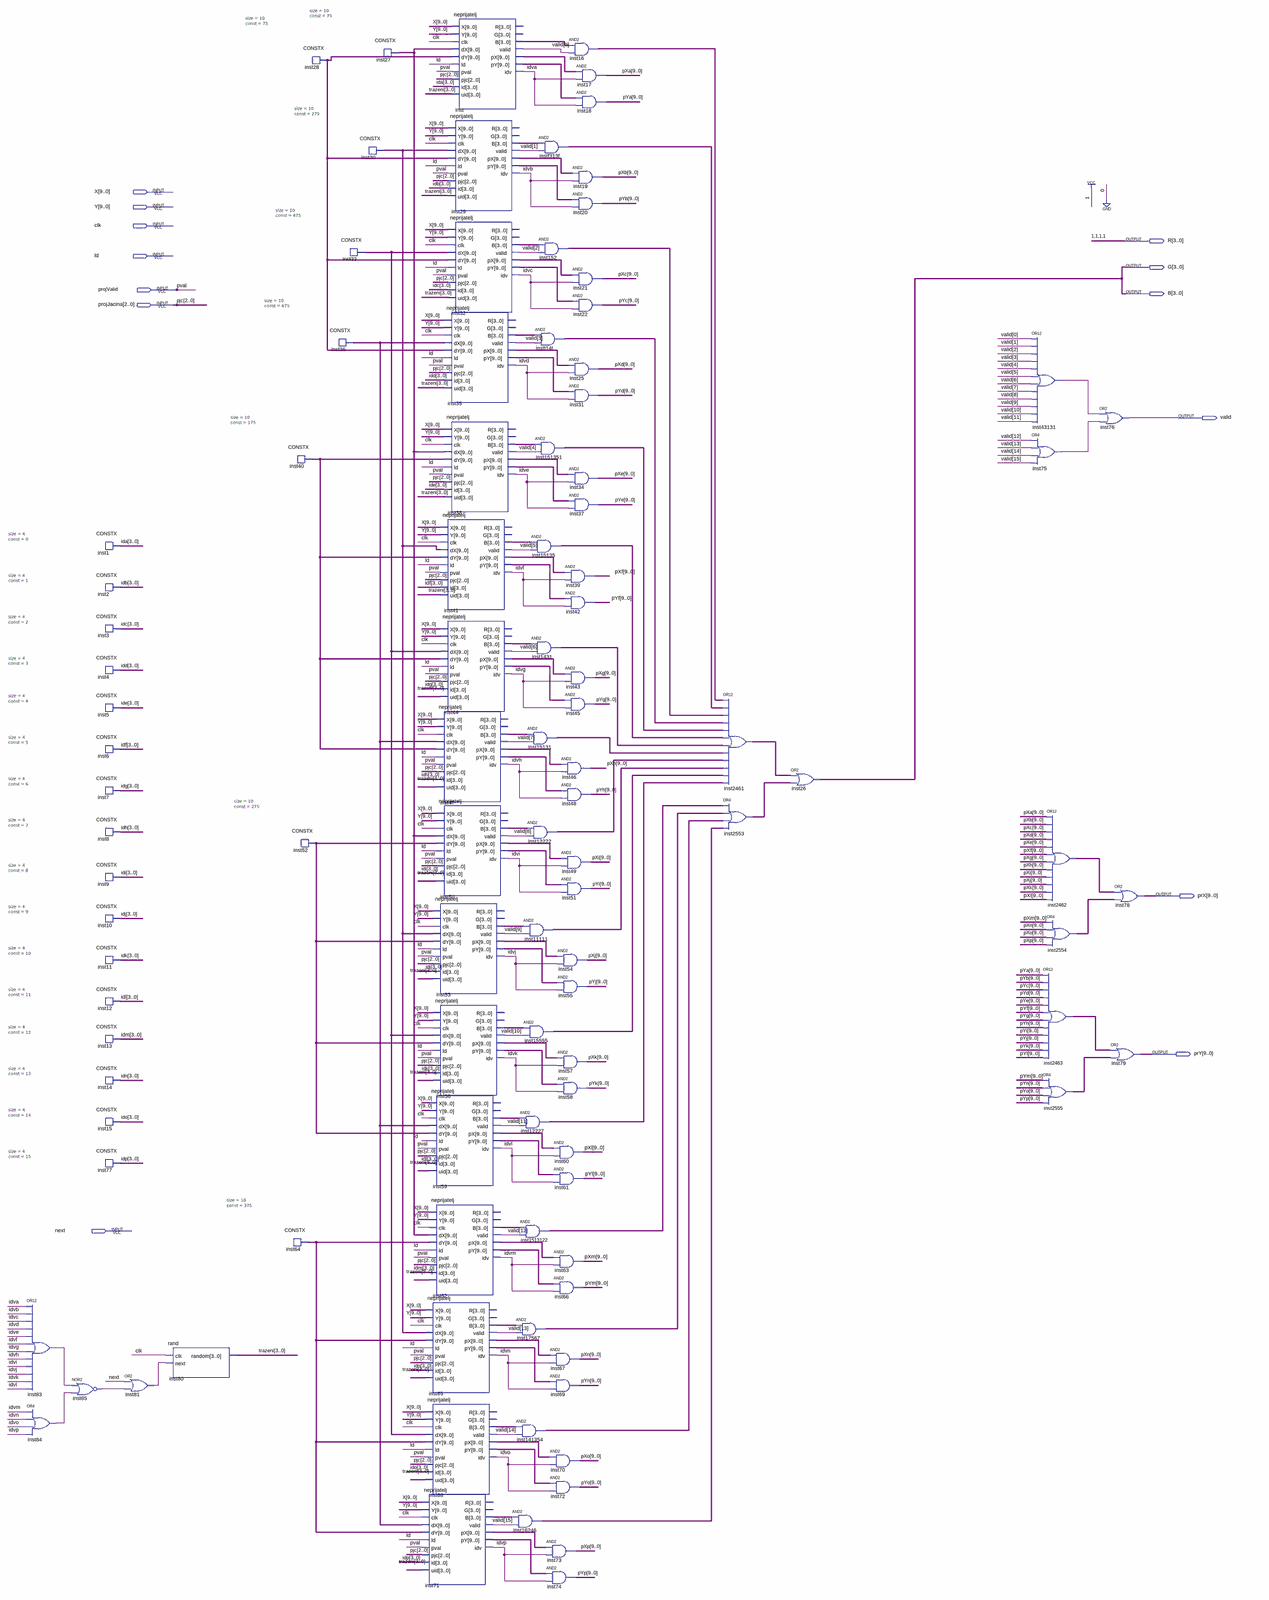
[diagram p0: schematic sheet, whole]
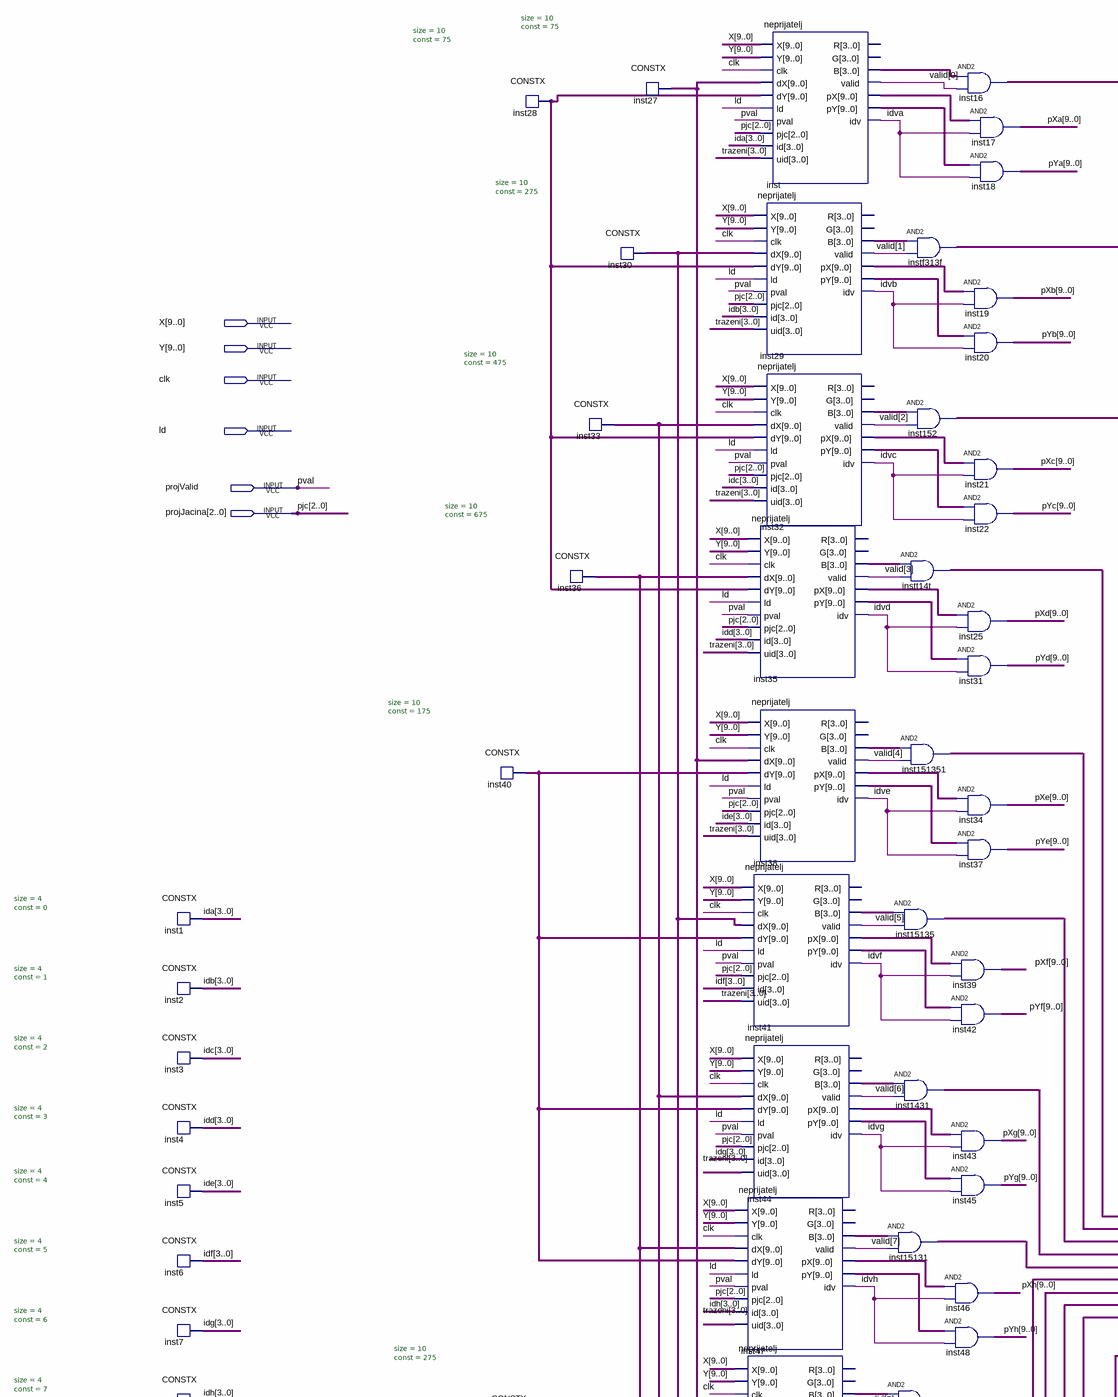
[diagram p1: schematic sheet, upper left part]
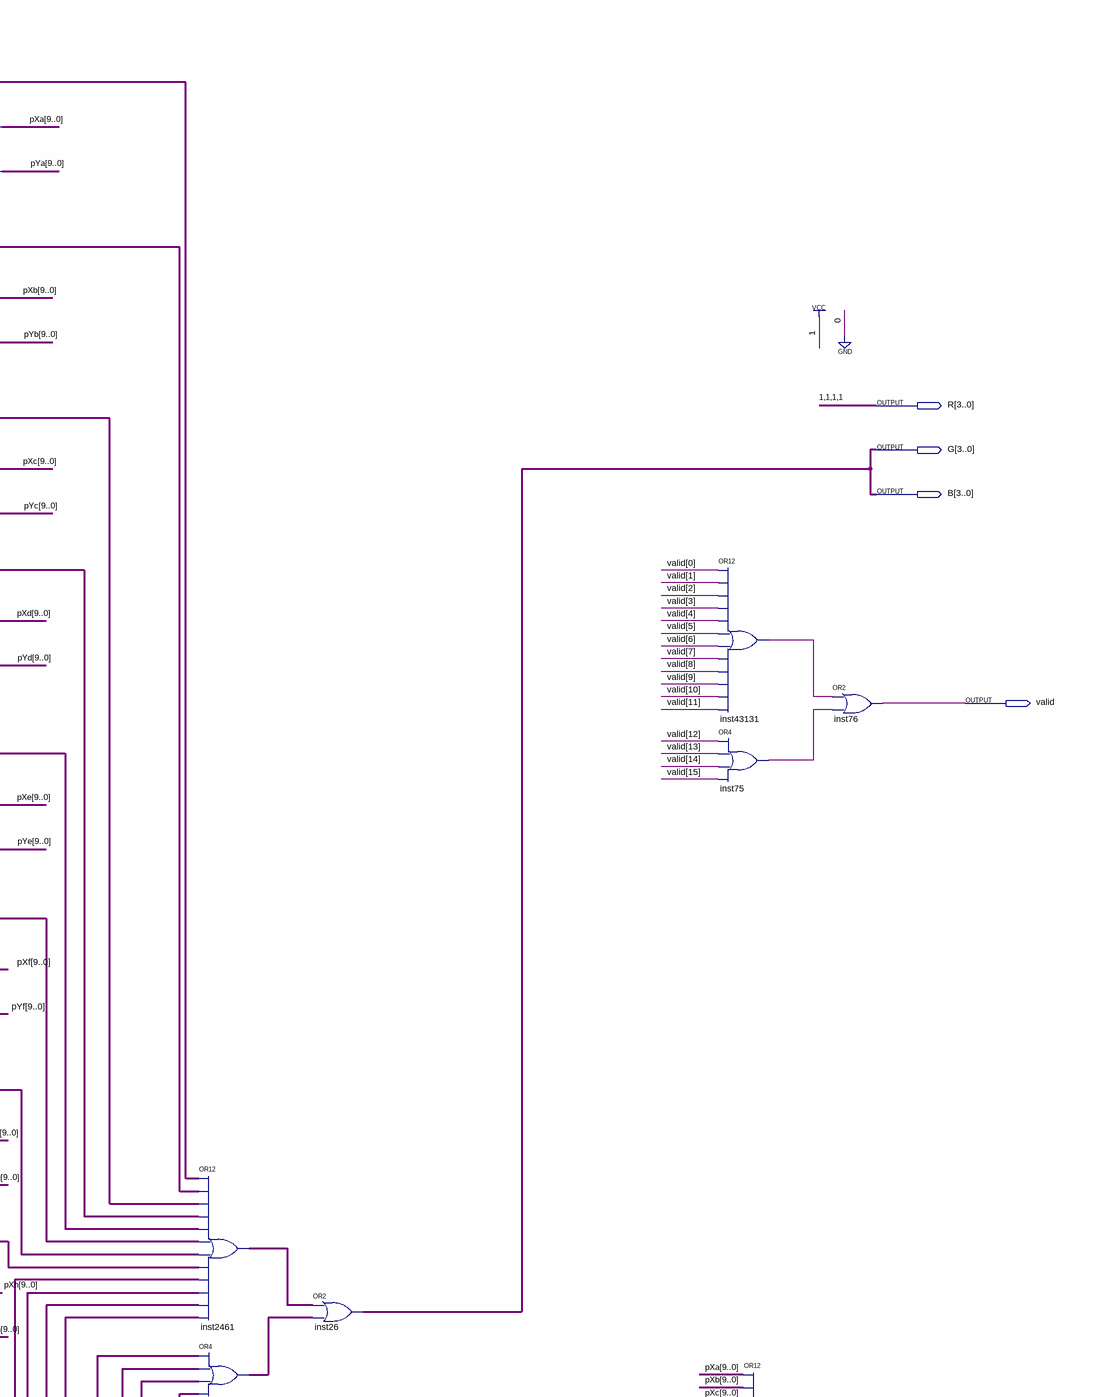
[diagram p2: schematic sheet, upper right part]
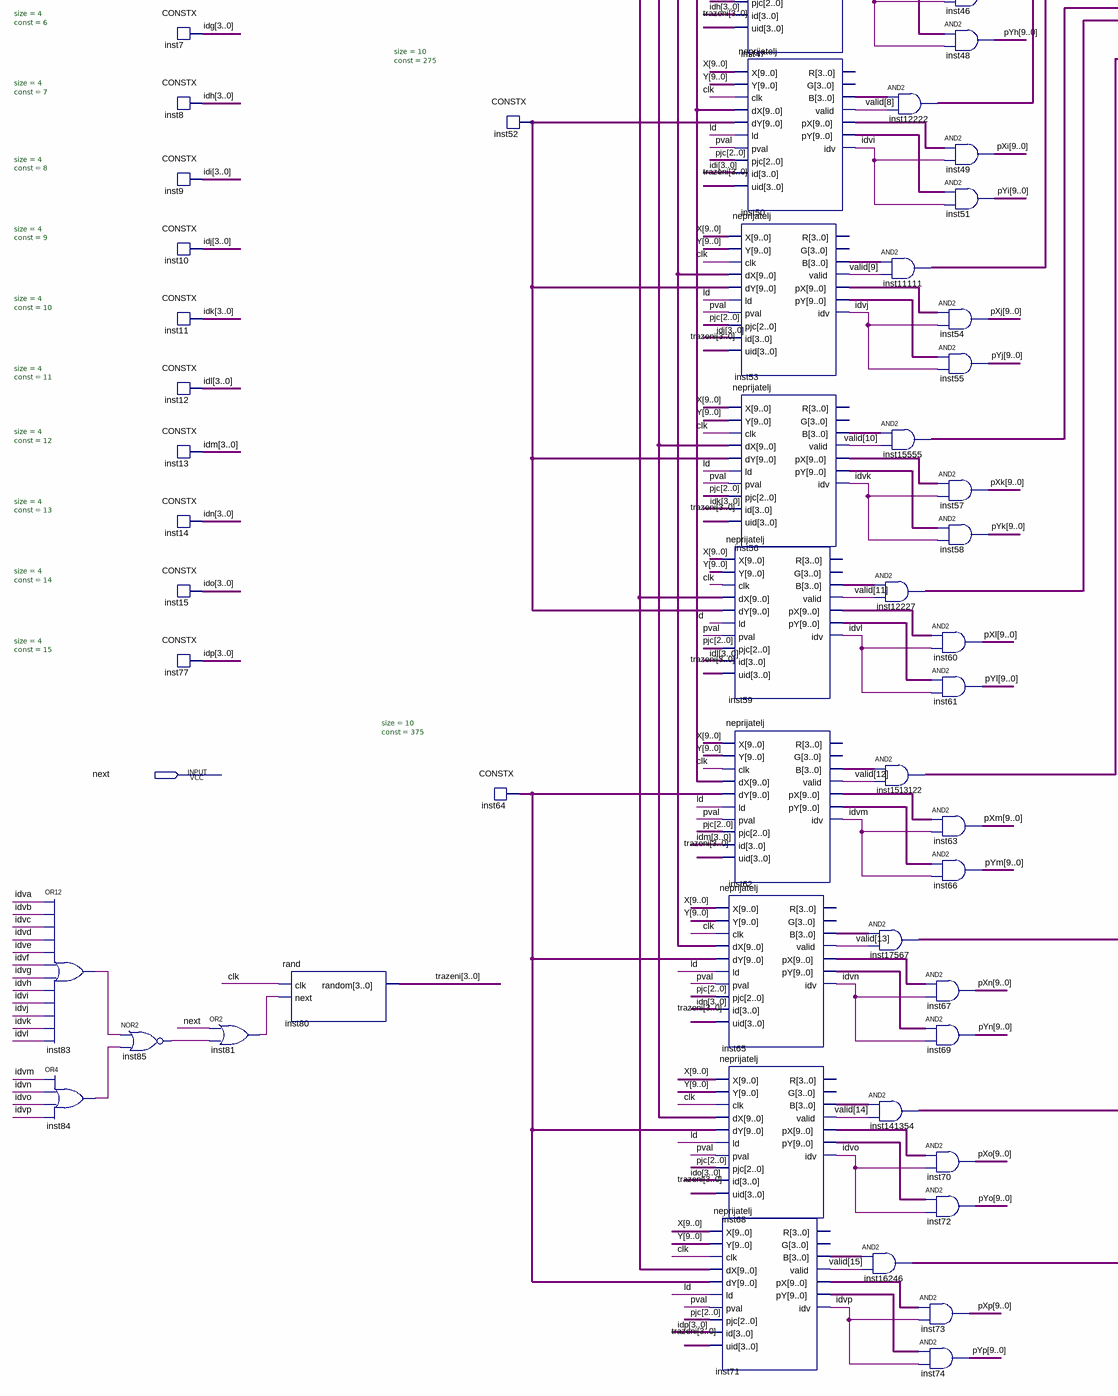
[diagram p3: schematic sheet, lower left part]
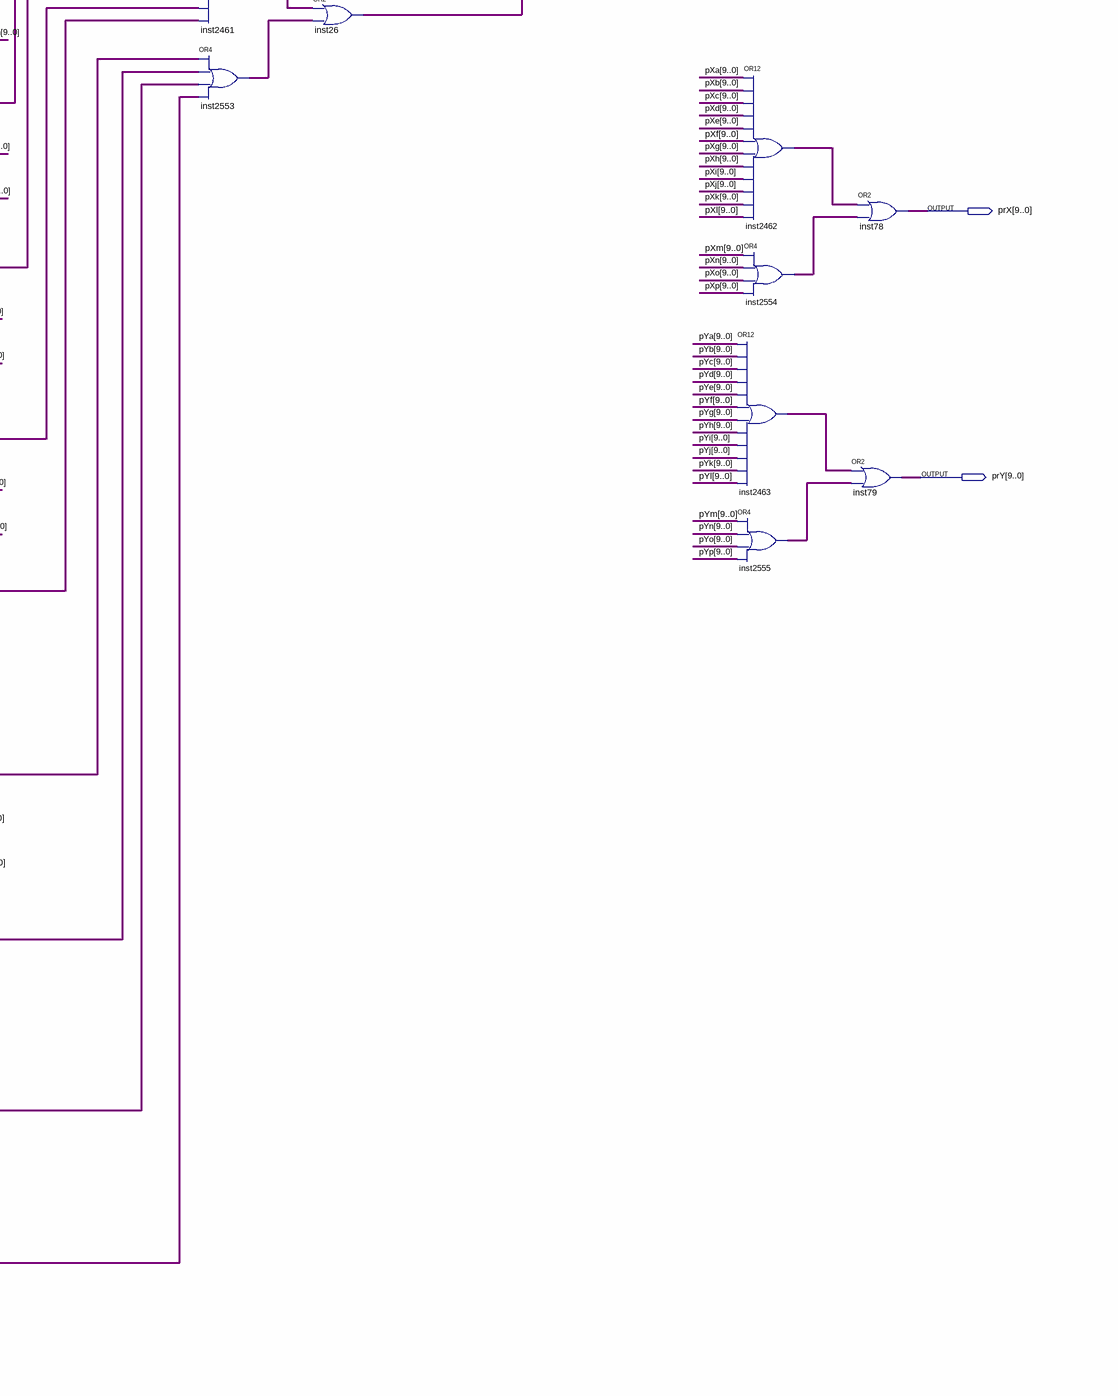
[diagram p4: schematic sheet, lower right part]
// Quartus schematic sviNeprijatelji.bdf as structural Verilog: 105 symbols, 13 pins
module sviNeprijatelji (
  input  [9:0] X,
  input  [9:0] Y,
  input  clk,
  input  ld,
  input  projValid,
  input  [2:0] projJacina,
  input  next,
  output [3:0] R,
  output [3:0] G,
  output [3:0] B,
  output valid,
  output [9:0] prX,
  output [9:0] prY
);

  wire idva, idvb, idvc, idvd, idve, idvf, idvg, idvh, idvi, idvj, idvk, idvl, idvm, idvn, idvo, idvp,
       inst75_out, inst81_out, inst83_out, inst84_out, inst85_out, inst43131_out;
  wire [3:0] ida, idb, idc, idd, ide, idf, idg, idh, idi, idj, idk, idl, idm, idn, ido, idp, inst16_out,
       inst29_b, inst32_b, inst35_b, inst38_b, inst41_b, inst44_b, inst47_b, inst50_b, inst53_b, inst56_b,
       inst59_b, inst62_b, inst65_b, inst68_b, inst71_b, inst152_out, inst1431_out, inst2461_out,
       inst2553_out, inst11111_out, inst12222_out, inst12227_out, inst15131_out, inst15135_out,
       inst15555_out, inst16246_out, inst17567_out, inst141354_out, inst151351_out, inst1513122_out, inst_b,
       instf313f_out, instt14t_out, trazeni;
  wire [9:0] inst27_data, inst28_data, inst29_px, inst29_py, inst30_data, inst32_px, inst32_py, inst33_data,
       inst35_px, inst35_py, inst36_data, inst38_px, inst38_py, inst40_data, inst41_px, inst41_py, inst44_px,
       inst44_py, inst47_px, inst47_py, inst50_px, inst50_py, inst52_data, inst53_px, inst53_py, inst56_px,
       inst56_py, inst59_px, inst59_py, inst62_px, inst62_py, inst64_data, inst65_px, inst65_py, inst68_px,
       inst68_py, inst71_px, inst71_py, inst2462_out, inst2463_out, inst2554_out, inst2555_out, inst_px,
       inst_py, pXa, pXb, pXc, pXd, pXe, pXf, pXg, pXh, pXi, pXj, pXk, pXl, pXm, pXn, pXo, pXp, pYa, pYb,
       pYc, pYd, pYe, pYf, pYg, pYh, pYi, pYj, pYk, pYl, pYm, pYn, pYo, pYp;
  wire [15:0] valid_bus;

  or inst83 (inst83_out, idva, idvb, idvc, idvd, idve, idvf, idvg, idvh, idvi, idvj, idvk, idvl);
  or inst84 (inst84_out, idvm, idvn, idvo, idvp);
  nor inst85 (inst85_out, inst83_out, inst84_out);
  CONSTX #(.size(4), .\const (0)) inst1 (.data(ida));
  CONSTX #(.size(4), .\const (1)) inst2 (.data(idb));
  CONSTX #(.size(4), .\const (2)) inst3 (.data(idc));
  CONSTX #(.size(4), .\const (3)) inst4 (.data(idd));
  CONSTX #(.size(4), .\const (4)) inst5 (.data(ide));
  CONSTX #(.size(4), .\const (5)) inst6 (.data(idf));
  CONSTX #(.size(4), .\const (6)) inst7 (.data(idg));
  CONSTX #(.size(4), .\const (7)) inst8 (.data(idh));
  CONSTX #(.size(4), .\const (8)) inst9 (.data(idi));
  CONSTX #(.size(4), .\const (9)) inst10 (.data(idj));
  CONSTX #(.size(4), .\const (10)) inst11 (.data(idk));
  CONSTX #(.size(4), .\const (11)) inst12 (.data(idl));
  CONSTX #(.size(4), .\const (12)) inst13 (.data(idm));
  CONSTX #(.size(4), .\const (13)) inst14 (.data(idn));
  CONSTX #(.size(4), .\const (14)) inst15 (.data(ido));
  CONSTX #(.size(4), .\const (15)) inst77 (.data(idp));
  or inst81 (inst81_out, next, inst85_out);
  \rand  inst80 (.clk(clk), .next(inst81_out), .random(trazeni));
  CONSTX #(.size(10), .\const (75)) inst28 (.data(inst28_data));
  CONSTX #(.size(10), .\const (175)) inst40 (.data(inst40_data));
  CONSTX #(.size(10), .\const (275)) inst52 (.data(inst52_data));
  CONSTX #(.size(10), .\const (375)) inst64 (.data(inst64_data));
  CONSTX #(.size(10), .\const (675)) inst36 (.data(inst36_data));
  CONSTX #(.size(10), .\const (275)) inst30 (.data(inst30_data));
  CONSTX #(.size(10), .\const (475)) inst33 (.data(inst33_data));
  CONSTX #(.size(10), .\const (75)) inst27 (.data(inst27_data));
  neprijatelj inst71 (
    .X(X), .Y(Y), .clk(clk), .dX(inst36_data), .dY(inst64_data), .ld(ld), .pval(projValid), .pjc(projJacina),
    .id(idp), .uid(trazeni), .B(inst71_b), .valid(valid_bus[15]), .pX(inst71_px), .pY(inst71_py), .idv(idvp));  // open: R, G
  neprijatelj inst (
    .X(X), .Y(Y), .clk(clk), .dX(inst27_data), .dY(inst28_data), .ld(ld), .pval(projValid), .pjc(projJacina),
    .id(ida), .uid(trazeni), .B(inst_b), .valid(valid_bus[0]), .pX(inst_px), .pY(inst_py), .idv(idva));  // open: R, G
  neprijatelj inst29 (
    .X(X), .Y(Y), .clk(clk), .dX(inst30_data), .dY(inst28_data), .ld(ld), .pval(projValid), .pjc(projJacina),
    .id(idb), .uid(trazeni), .B(inst29_b), .valid(valid_bus[1]), .pX(inst29_px), .pY(inst29_py), .idv(idvb));  // open: R, G
  neprijatelj inst32 (
    .X(X), .Y(Y), .clk(clk), .dX(inst33_data), .dY(inst28_data), .ld(ld), .pval(projValid), .pjc(projJacina),
    .id(idc), .uid(trazeni), .B(inst32_b), .valid(valid_bus[2]), .pX(inst32_px), .pY(inst32_py), .idv(idvc));  // open: R, G
  neprijatelj inst35 (
    .X(X), .Y(Y), .clk(clk), .dX(inst36_data), .dY(inst28_data), .ld(ld), .pval(projValid), .pjc(projJacina),
    .id(idd), .uid(trazeni), .B(inst35_b), .valid(valid_bus[3]), .pX(inst35_px), .pY(inst35_py), .idv(idvd));  // open: R, G
  neprijatelj inst38 (
    .X(X), .Y(Y), .clk(clk), .dX(inst27_data), .dY(inst40_data), .ld(ld), .pval(projValid), .pjc(projJacina),
    .id(ide), .uid(trazeni), .B(inst38_b), .valid(valid_bus[4]), .pX(inst38_px), .pY(inst38_py), .idv(idve));  // open: R, G
  neprijatelj inst41 (
    .X(X), .Y(Y), .clk(clk), .dX(inst30_data), .dY(inst40_data), .ld(ld), .pval(projValid), .pjc(projJacina),
    .id(idf), .uid(trazeni), .B(inst41_b), .valid(valid_bus[5]), .pX(inst41_px), .pY(inst41_py), .idv(idvf));  // open: R, G
  neprijatelj inst44 (
    .X(X), .Y(Y), .clk(clk), .dX(inst33_data), .dY(inst40_data), .ld(ld), .pval(projValid), .pjc(projJacina),
    .id(idg), .uid(trazeni), .B(inst44_b), .valid(valid_bus[6]), .pX(inst44_px), .pY(inst44_py), .idv(idvg));  // open: R, G
  neprijatelj inst47 (
    .X(X), .Y(Y), .clk(clk), .dX(inst36_data), .dY(inst40_data), .ld(ld), .pval(projValid), .pjc(projJacina),
    .id(idh), .uid(trazeni), .B(inst47_b), .valid(valid_bus[7]), .pX(inst47_px), .pY(inst47_py), .idv(idvh));  // open: R, G
  neprijatelj inst50 (
    .X(X), .Y(Y), .clk(clk), .dX(inst27_data), .dY(inst52_data), .ld(ld), .pval(projValid), .pjc(projJacina),
    .id(idi), .uid(trazeni), .B(inst50_b), .valid(valid_bus[8]), .pX(inst50_px), .pY(inst50_py), .idv(idvi));  // open: R, G
  neprijatelj inst53 (
    .X(X), .Y(Y), .clk(clk), .dX(inst30_data), .dY(inst52_data), .ld(ld), .pval(projValid), .pjc(projJacina),
    .id(idj), .uid(trazeni), .B(inst53_b), .valid(valid_bus[9]), .pX(inst53_px), .pY(inst53_py), .idv(idvj));  // open: R, G
  neprijatelj inst56 (
    .X(X), .Y(Y), .clk(clk), .dX(inst33_data), .dY(inst52_data), .ld(ld), .pval(projValid), .pjc(projJacina),
    .id(idk), .uid(trazeni), .B(inst56_b), .valid(valid_bus[10]), .pX(inst56_px), .pY(inst56_py), .idv(idvk));  // open: R, G
  neprijatelj inst59 (
    .X(X), .Y(Y), .clk(clk), .dX(inst36_data), .dY(inst52_data), .ld(ld), .pval(projValid), .pjc(projJacina),
    .id(idl), .uid(trazeni), .B(inst59_b), .valid(valid_bus[11]), .pX(inst59_px), .pY(inst59_py), .idv(idvl));  // open: R, G
  neprijatelj inst62 (
    .X(X), .Y(Y), .clk(clk), .dX(inst27_data), .dY(inst64_data), .ld(ld), .pval(projValid), .pjc(projJacina),
    .id(idm), .uid(trazeni), .B(inst62_b), .valid(valid_bus[12]), .pX(inst62_px), .pY(inst62_py), .idv(idvm));  // open: R, G
  neprijatelj inst65 (
    .X(X), .Y(Y), .clk(clk), .dX(inst30_data), .dY(inst64_data), .ld(ld), .pval(projValid), .pjc(projJacina),
    .id(idn), .uid(trazeni), .B(inst65_b), .valid(valid_bus[13]), .pX(inst65_px), .pY(inst65_py), .idv(idvn));  // open: R, G
  neprijatelj inst68 (
    .X(X), .Y(Y), .clk(clk), .dX(inst33_data), .dY(inst64_data), .ld(ld), .pval(projValid), .pjc(projJacina),
    .id(ido), .uid(trazeni), .B(inst68_b), .valid(valid_bus[14]), .pX(inst68_px), .pY(inst68_py), .idv(idvo));  // open: R, G
  assign inst16246_out = inst71_b & {4{valid_bus[15]}};  // AND2 inst16246, 4 bits wide
  assign instf313f_out = inst29_b & {4{valid_bus[1]}};  // AND2 instf313f, 4 bits wide
  assign inst152_out = inst32_b & {4{valid_bus[2]}};  // AND2 inst152, 4 bits wide
  assign instt14t_out = inst35_b & {4{valid_bus[3]}};  // AND2 instt14t, 4 bits wide
  assign inst151351_out = inst38_b & {4{valid_bus[4]}};  // AND2 inst151351, 4 bits wide
  assign inst15135_out = inst41_b & {4{valid_bus[5]}};  // AND2 inst15135, 4 bits wide
  assign inst1431_out = inst44_b & {4{valid_bus[6]}};  // AND2 inst1431, 4 bits wide
  assign inst15131_out = inst47_b & {4{valid_bus[7]}};  // AND2 inst15131, 4 bits wide
  assign inst12222_out = inst50_b & {4{valid_bus[8]}};  // AND2 inst12222, 4 bits wide
  assign inst11111_out = inst53_b & {4{valid_bus[9]}};  // AND2 inst11111, 4 bits wide
  assign inst15555_out = inst56_b & {4{valid_bus[10]}};  // AND2 inst15555, 4 bits wide
  assign inst12227_out = inst59_b & {4{valid_bus[11]}};  // AND2 inst12227, 4 bits wide
  assign inst1513122_out = inst62_b & {4{valid_bus[12]}};  // AND2 inst1513122, 4 bits wide
  assign inst17567_out = inst65_b & {4{valid_bus[13]}};  // AND2 inst17567, 4 bits wide
  assign inst141354_out = inst68_b & {4{valid_bus[14]}};  // AND2 inst141354, 4 bits wide
  assign inst16_out = inst_b & {4{valid_bus[0]}};  // AND2 inst16, 4 bits wide
  assign pXb = inst29_px & {10{idvb}};  // AND2 inst19, 10 bits wide
  assign pYb = inst29_py & {10{idvb}};  // AND2 inst20, 10 bits wide
  assign pXc = inst32_px & {10{idvc}};  // AND2 inst21, 10 bits wide
  assign pYc = inst32_py & {10{idvc}};  // AND2 inst22, 10 bits wide
  assign pXd = inst35_px & {10{idvd}};  // AND2 inst25, 10 bits wide
  assign pYd = inst35_py & {10{idvd}};  // AND2 inst31, 10 bits wide
  assign pXe = inst38_px & {10{idve}};  // AND2 inst34, 10 bits wide
  assign pYe = inst38_py & {10{idve}};  // AND2 inst37, 10 bits wide
  assign pXf = inst41_px & {10{idvf}};  // AND2 inst39, 10 bits wide
  assign pYf = inst41_py & {10{idvf}};  // AND2 inst42, 10 bits wide
  assign pXg = inst44_px & {10{idvg}};  // AND2 inst43, 10 bits wide
  assign pYg = inst44_py & {10{idvg}};  // AND2 inst45, 10 bits wide
  assign pXh = inst47_px & {10{idvh}};  // AND2 inst46, 10 bits wide
  assign pYh = inst47_py & {10{idvh}};  // AND2 inst48, 10 bits wide
  assign pXi = inst50_px & {10{idvi}};  // AND2 inst49, 10 bits wide
  assign pYi = inst50_py & {10{idvi}};  // AND2 inst51, 10 bits wide
  assign pXj = inst53_px & {10{idvj}};  // AND2 inst54, 10 bits wide
  assign pYj = inst53_py & {10{idvj}};  // AND2 inst55, 10 bits wide
  assign pXk = inst56_px & {10{idvk}};  // AND2 inst57, 10 bits wide
  assign pYk = inst56_py & {10{idvk}};  // AND2 inst58, 10 bits wide
  assign pXl = inst59_px & {10{idvl}};  // AND2 inst60, 10 bits wide
  assign pYl = inst59_py & {10{idvl}};  // AND2 inst61, 10 bits wide
  assign pXm = inst62_px & {10{idvm}};  // AND2 inst63, 10 bits wide
  assign pYm = inst62_py & {10{idvm}};  // AND2 inst66, 10 bits wide
  assign pXn = inst65_px & {10{idvn}};  // AND2 inst67, 10 bits wide
  assign pYn = inst65_py & {10{idvn}};  // AND2 inst69, 10 bits wide
  assign pXo = inst68_px & {10{idvo}};  // AND2 inst70, 10 bits wide
  assign pYo = inst68_py & {10{idvo}};  // AND2 inst72, 10 bits wide
  assign pXp = inst71_px & {10{idvp}};  // AND2 inst73, 10 bits wide
  assign pYp = inst71_py & {10{idvp}};  // AND2 inst74, 10 bits wide
  assign pXa = inst_px & {10{idva}};  // AND2 inst17, 10 bits wide
  assign pYa = inst_py & {10{idva}};  // AND2 inst18, 10 bits wide
  assign inst2461_out = inst16_out | instf313f_out | inst152_out | instt14t_out | inst151351_out | inst15135_out | inst1431_out | inst15131_out | inst12222_out | inst11111_out | inst15555_out | inst12227_out;  // OR12 inst2461, 4 bits wide
  assign inst2553_out = inst1513122_out | inst17567_out | inst141354_out | inst16246_out;  // OR4 inst2553, 4 bits wide
  assign B = inst2461_out | inst2553_out;  // OR2 inst26, 4 bits wide
  or inst43131 (inst43131_out, valid_bus[0], valid_bus[1], valid_bus[2], valid_bus[3], valid_bus[4], valid_bus[5], valid_bus[6], valid_bus[7], valid_bus[8], valid_bus[9], valid_bus[10], valid_bus[11]);
  or inst75 (inst75_out, valid_bus[12], valid_bus[13], valid_bus[14], valid_bus[15]);
  assign inst2462_out = pXa | pXb | pXc | pXd | pXe | pXf | pXg | pXh | pXi | pXj | pXk | pXl;  // OR12 inst2462, 10 bits wide
  assign inst2554_out = pXm | pXn | pXo | pXp;  // OR4 inst2554, 10 bits wide
  assign inst2463_out = pYa | pYb | pYc | pYd | pYe | pYf | pYg | pYh | pYi | pYj | pYk | pYl;  // OR12 inst2463, 10 bits wide
  assign inst2555_out = pYm | pYn | pYo | pYp;  // OR4 inst2555, 10 bits wide
  or inst76 (valid, inst43131_out, inst75_out);
  assign prX = inst2462_out | inst2554_out;  // OR2 inst78, 10 bits wide
  assign prY = inst2463_out | inst2555_out;  // OR2 inst79, 10 bits wide

  assign G = B;
  assign R = 4'b1111;

  // Other names for the same wires on the sheet: pjc[2:0] = projJacina; pval = projValid
endmodule
